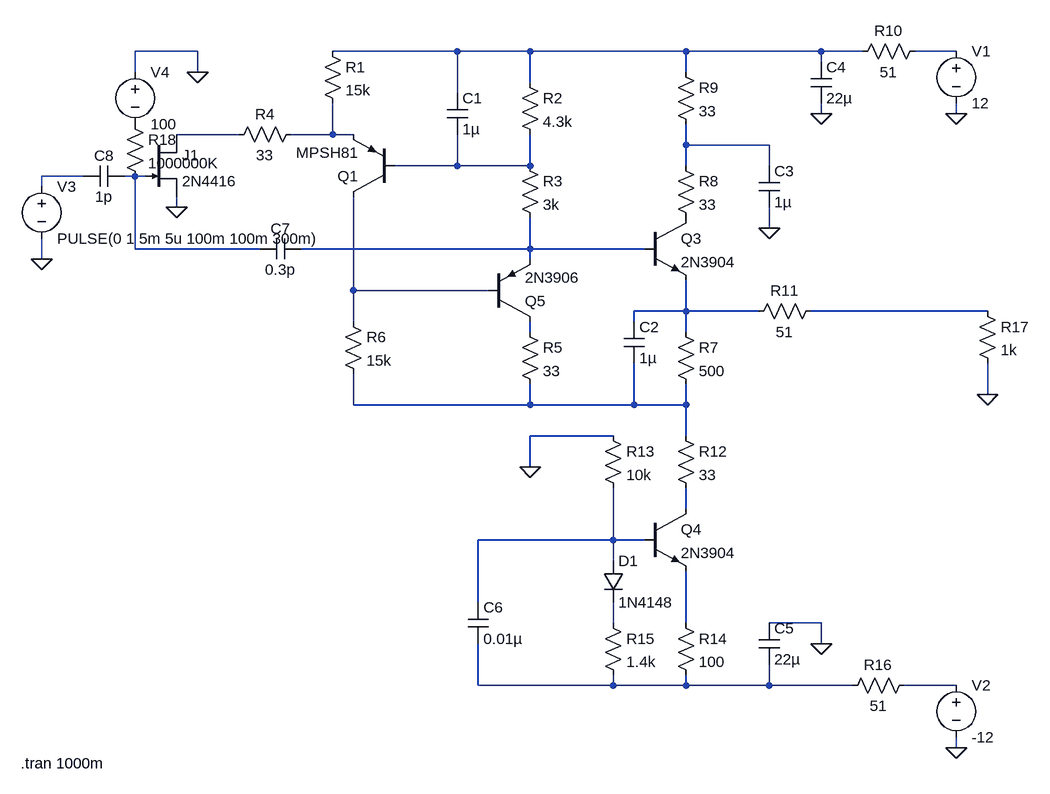
[diagram p0: schematic Figure3.asc]
Figure3.asc, the LTspice schematic file:
Version 4
SHEET 1 948 824
WIRE -336 -288 -432 -288
WIRE 64 -288 -128 -288
WIRE 176 -288 64 -288
WIRE 416 -288 176 -288
WIRE 624 -288 416 -288
WIRE 688 -288 624 -288
WIRE 832 -288 768 -288
WIRE 624 -272 624 -288
WIRE -432 -256 -432 -288
WIRE -336 -256 -336 -288
WIRE 416 -256 416 -288
WIRE 176 -240 176 -288
WIRE 64 -224 64 -288
WIRE 624 -192 624 -208
WIRE 832 -192 832 -208
WIRE -272 -160 -368 -160
WIRE -128 -160 -128 -208
WIRE -128 -160 -192 -160
WIRE -96 -160 -128 -160
WIRE 416 -144 416 -176
WIRE 544 -144 416 -144
WIRE 64 -112 64 -160
WIRE 64 -112 -32 -112
WIRE 176 -112 176 -160
WIRE 176 -112 64 -112
WIRE 416 -112 416 -144
WIRE 544 -112 544 -144
WIRE -512 -96 -576 -96
WIRE -432 -96 -448 -96
WIRE -416 -96 -432 -96
WIRE -576 -80 -576 -96
WIRE -368 -48 -368 -64
WIRE 544 -16 544 -48
WIRE -432 16 -432 -96
WIRE -240 16 -432 16
WIRE 176 16 176 -32
WIRE 176 16 -176 16
WIRE 352 16 176 16
WIRE -576 32 -576 0
WIRE 176 32 176 16
WIRE -96 80 -96 -64
WIRE 112 80 -96 80
WIRE 416 112 416 64
WIRE 416 112 336 112
WIRE 528 112 416 112
WIRE 880 112 608 112
WIRE -96 128 -96 80
WIRE 336 128 336 112
WIRE 176 144 176 128
WIRE 416 144 416 112
WIRE 880 240 880 192
WIRE -96 256 -96 208
WIRE 176 256 176 224
WIRE 176 256 -96 256
WIRE 336 256 336 192
WIRE 336 256 176 256
WIRE 416 256 416 224
WIRE 416 256 336 256
WIRE 304 304 176 304
WIRE 416 304 416 256
WIRE 176 352 176 304
WIRE 416 416 416 384
WIRE 304 464 304 384
WIRE 304 464 96 464
WIRE 352 464 304 464
WIRE 304 496 304 464
WIRE 96 560 96 464
WIRE 304 592 304 560
WIRE 416 592 416 512
WIRE 624 592 544 592
WIRE 624 624 624 592
WIRE 96 688 96 624
WIRE 304 688 304 672
WIRE 304 688 96 688
WIRE 416 688 416 672
WIRE 416 688 304 688
WIRE 544 688 544 656
WIRE 544 688 416 688
WIRE 672 688 544 688
WIRE 832 688 752 688
WIRE 832 784 832 768
FLAG 544 -16 0
FLAG 624 -192 0
FLAG 176 352 0
FLAG 624 624 0
FLAG 832 784 0
FLAG 832 -192 0
FLAG 880 240 0
FLAG -576 32 0
FLAG -368 -48 0
FLAG -336 -256 0
SYMBOL res -144 -304 R0
SYMATTR InstName R1
SYMATTR Value 15k
SYMBOL cap 48 -224 R0
SYMATTR InstName C1
SYMATTR Value 1µ
SYMBOL res 160 -256 R0
SYMATTR InstName R2
SYMATTR Value 4.3k
SYMBOL pnp -32 -64 R180
SYMATTR InstName Q1
SYMATTR Value MPSH81
SYMBOL res 160 -128 R0
SYMATTR InstName R3
SYMATTR Value 3k
SYMBOL res -176 -176 R90
WINDOW 0 0 56 VBottom 2
WINDOW 3 32 56 VTop 2
SYMATTR InstName R4
SYMATTR Value 33
SYMBOL res 160 128 R0
SYMATTR InstName R5
SYMATTR Value 33
SYMBOL res -112 112 R0
SYMATTR InstName R6
SYMATTR Value 15k
SYMBOL npn 352 -32 R0
SYMATTR InstName Q3
SYMATTR Value 2N3904
SYMBOL cap 320 128 R0
SYMATTR InstName C2
SYMATTR Value 1µ
SYMBOL res 400 128 R0
SYMATTR InstName R7
SYMATTR Value 500
SYMBOL res 400 -128 R0
SYMATTR InstName R8
SYMATTR Value 33
SYMBOL res 400 -272 R0
SYMATTR InstName R9
SYMATTR Value 33
SYMBOL cap 528 -112 R0
SYMATTR InstName C3
SYMATTR Value 1µ
SYMBOL cap 608 -272 R0
SYMATTR InstName C4
SYMATTR Value 22µ
SYMBOL res 784 -304 R90
WINDOW 0 0 56 VBottom 2
WINDOW 3 32 56 VTop 2
SYMATTR InstName R10
SYMATTR Value 51
SYMBOL res 624 96 R90
WINDOW 0 0 56 VBottom 2
WINDOW 3 32 56 VTop 2
SYMATTR InstName R11
SYMATTR Value 51
SYMBOL res 400 288 R0
SYMATTR InstName R12
SYMATTR Value 33
SYMBOL res 288 288 R0
SYMATTR InstName R13
SYMATTR Value 10k
SYMBOL npn 352 416 R0
SYMATTR InstName Q4
SYMATTR Value 2N3904
SYMBOL res 400 576 R0
SYMATTR InstName R14
SYMATTR Value 100
SYMBOL cap 528 592 R0
SYMATTR InstName C5
SYMATTR Value 22µ
SYMBOL diode 288 496 R0
SYMATTR InstName D1
SYMATTR Value 1N4148
SYMBOL res 288 576 R0
SYMATTR InstName R15
SYMATTR Value 1.4k
SYMBOL cap 80 560 R0
SYMATTR InstName C6
SYMATTR Value 0.01µ
SYMBOL res 768 672 R90
WINDOW 0 0 56 VBottom 2
WINDOW 3 32 56 VTop 2
SYMATTR InstName R16
SYMATTR Value 51
SYMBOL njf -416 -160 R0
SYMATTR InstName J1
SYMATTR Value 2N4416
SYMBOL voltage 832 -304 R0
WINDOW 123 0 0 Left 0
WINDOW 39 0 0 Left 0
SYMATTR InstName V1
SYMATTR Value 12
SYMBOL voltage 832 672 R0
WINDOW 123 0 0 Left 0
WINDOW 39 0 0 Left 0
SYMATTR InstName V2
SYMATTR Value -12
SYMBOL res 864 96 R0
SYMATTR InstName R17
SYMATTR Value 1k
SYMBOL cap -176 0 R90
WINDOW 0 0 32 VBottom 2
WINDOW 3 32 32 VTop 2
SYMATTR InstName C7
SYMATTR Value 0.3p
SYMBOL pnp 112 128 M180
SYMATTR InstName Q5
SYMATTR Value 2N3906
SYMBOL voltage -576 -96 R0
WINDOW 123 0 0 Left 0
WINDOW 39 0 0 Left 0
SYMATTR InstName V3
SYMATTR Value PULSE(0 1 5m 5u 100m 100m 300m)
SYMBOL cap -448 -112 R90
WINDOW 0 0 32 VBottom 2
WINDOW 3 32 32 VTop 2
SYMATTR InstName C8
SYMATTR Value 1p
SYMBOL res -448 -192 R0
SYMATTR InstName R18
SYMATTR Value 1000000K
SYMBOL voltage -432 -272 R0
WINDOW 123 0 0 Left 0
WINDOW 39 0 0 Left 0
SYMATTR InstName V4
SYMATTR Value 100
TEXT -608 808 Left 2 !.tran 1000m

The netlist it stands for:
* Figure3.asc
R1 N001 N004 15k
C1 N001 N006 1µ
R2 N001 N006 4.3k
Q1 N010 N006 N004 0 MPSH81
R3 N006 N009 3k
R4 N004 N003 33
R5 N013 N014 33
R6 N010 N014 15k
Q3 P001 N009 N011 0 2N3904
C2 N011 N014 1µ
R7 N011 N014 500
R8 N005 P001 33
R9 N001 N005 33
C3 N005 0 1µ
C4 N001 0 22µ
R10 N002 N001 51
R11 N012 N011 51
R12 N014 N015 33
R13 0 N016 10k
Q4 N015 N016 N018 0 2N3904
R14 N018 N019 100
C5 0 N019 22µ
D1 N016 N017 1N4148
R15 N017 N019 1.4k
C6 N016 N019 0.01µ
R16 N020 N019 51
J1 N003 N008 0 2N4416
V1 N002 0 12
V2 N020 0 -12
R17 N012 0 1k
C7 N009 N008 0.3p
Q5 N013 N010 N009 0 2N3906
V3 N007 0 PULSE(0 1 5m 5u 100m 100m 300m)
C8 N008 N007 1p
R18 P002 N008 1000000K
V4 0 P002 100
.model D D
.lib standard.dio
.model NPN NPN
.model PNP PNP
.lib standard.bjt
.model NJF NJF
.model PJF PJF
.lib standard.jft
.tran 1000m
.backanno
.end